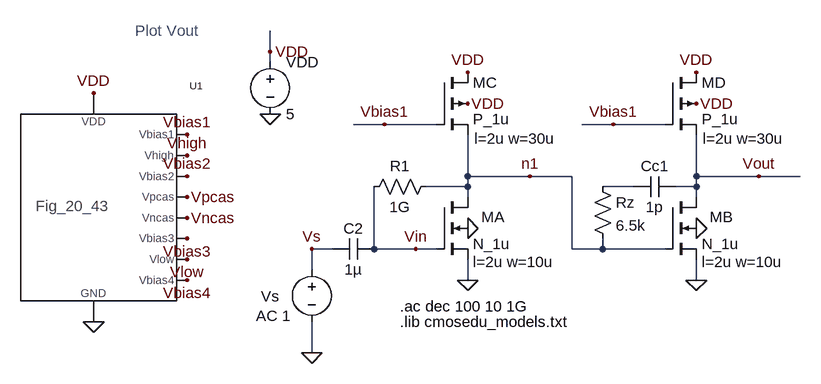
[diagram p0: schematic Fig21_34.asc]
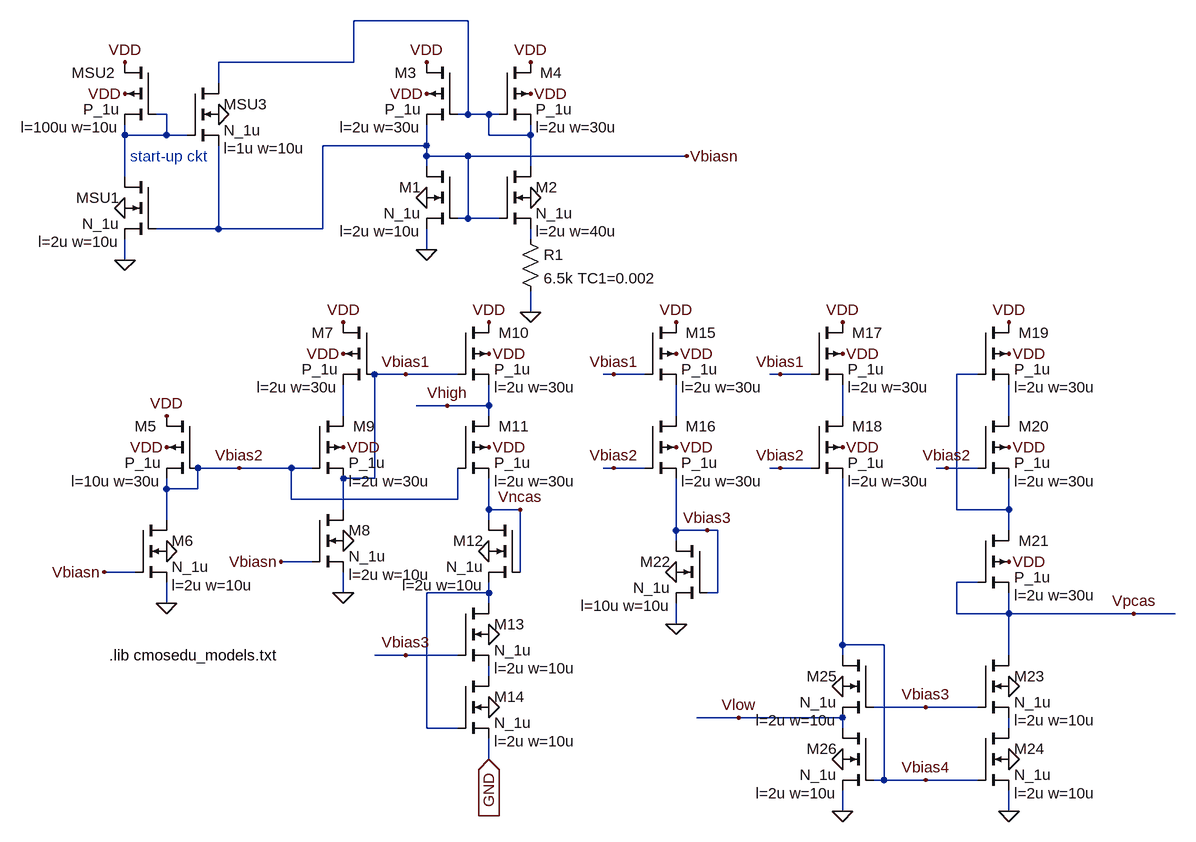
[diagram p1: sub-circuit fig_20_43.asc]
Fig21_34.asc, the LTspice schematic file:
Version 4
SHEET 1 1976 680
WIRE 1072 -304 1072 -336
WIRE 1072 -288 1072 -304
WIRE 1136 32 1136 0
WIRE 1136 160 1136 112
WIRE 1168 0 1136 0
WIRE 1232 0 1232 -96
WIRE 1248 -192 1200 -192
WIRE 1296 0 1232 0
WIRE 1328 -192 1248 -192
WIRE 1328 0 1296 0
WIRE 1376 -112 1376 -176
WIRE 1376 -96 1312 -96
WIRE 1376 -96 1376 -112
WIRE 1376 -80 1376 -96
WIRE 1376 48 1376 16
WIRE 1472 -112 1376 -112
WIRE 1536 -112 1472 -112
WIRE 1536 0 1536 -112
WIRE 1584 0 1536 0
WIRE 1584 0 1584 -16
WIRE 1600 -192 1552 -192
WIRE 1632 -96 1584 -96
WIRE 1680 -192 1600 -192
WIRE 1680 0 1584 0
WIRE 1728 -112 1728 -176
WIRE 1728 -96 1696 -96
WIRE 1728 -96 1728 -112
WIRE 1728 -80 1728 -96
WIRE 1728 48 1728 16
WIRE 1824 -112 1728 -112
WIRE 1888 -112 1824 -112
FLAG 1072 -208 0
FLAG 1072 -304 VDD
FLAG 1376 -32 0
FLAG 1376 48 0
FLAG 1376 -272 VDD
FLAG 1376 -224 VDD
FLAG 800 -240 VDD
FLAG 800 112 0
FLAG 944 -176 Vbias1
FLAG 944 -144 Vhigh
FLAG 944 -112 Vbias2
FLAG 944 -16 Vbias3
FLAG 944 -80 Vpcas
FLAG 944 -48 Vncas
FLAG 944 48 Vbias4
FLAG 944 16 Vlow
FLAG 1136 160 0
FLAG 1296 0 Vin
FLAG 1248 -192 Vbias1
FLAG 1136 0 Vs
FLAG 1728 -32 0
FLAG 1728 48 0
FLAG 1728 -272 VDD
FLAG 1728 -224 VDD
FLAG 1824 -112 Vout
FLAG 1600 -192 Vbias1
FLAG 1472 -112 n1
SYMBOL voltage 1072 -304 R0
WINDOW 123 0 0 Left 0
WINDOW 39 0 0 Left 0
SYMATTR InstName VDD
SYMATTR Value 5
SYMBOL nmos4 1328 -80 R0
WINDOW 123 56 100 Left 0
WINDOW 0 69 31 Left 0
SYMATTR Value2 l=2u w=10u
SYMATTR InstName MA
SYMATTR Value N_1u
SYMBOL pmos4 1328 -272 R0
WINDOW 123 58 102 Left 0
WINDOW 0 56 16 Left 0
SYMATTR Value2 l=2u w=30u
SYMATTR InstName MC
SYMATTR Value P_1u
SYMBOL Fig_20_43 800 -64 R0
SYMATTR InstName U1
SYMBOL voltage 1136 16 R0
WINDOW 123 -86 87 Left 0
WINDOW 39 0 0 Left 0
WINDOW 3 30 93 Left 0
WINDOW 0 -78 57 Left 0
SYMATTR Value2 AC 1
SYMATTR Value ""
SYMATTR InstName Vs
SYMBOL res 1216 -80 R270
WINDOW 0 32 56 VTop 0
WINDOW 3 0 56 VBottom 0
SYMATTR InstName R1
SYMATTR Value 1G
SYMBOL cap 1168 16 R270
WINDOW 0 32 32 VTop 0
WINDOW 3 0 32 VBottom 0
SYMATTR InstName C2
SYMATTR Value 1µ
SYMBOL nmos4 1680 -80 R0
WINDOW 123 56 100 Left 0
WINDOW 0 69 31 Left 0
SYMATTR Value2 l=2u w=10u
SYMATTR InstName MB
SYMATTR Value N_1u
SYMBOL pmos4 1680 -272 R0
WINDOW 123 58 102 Left 0
WINDOW 0 56 16 Left 0
SYMATTR Value2 l=2u w=30u
SYMATTR InstName MD
SYMATTR Value P_1u
SYMBOL cap 1632 -80 R270
WINDOW 0 32 32 VTop 0
WINDOW 3 0 32 VBottom 0
SYMATTR InstName Cc1
SYMATTR Value 1p
SYMBOL res 1568 -112 R0
SYMATTR InstName Rz
SYMATTR Value 6.5k
TEXT 1272 112 Left 0 !.lib cmosedu_models.txt
TEXT 864 -336 Left 0 ;Plot Vout
TEXT 1272 88 Left 0 !.ac dec 100 10 1G

fig_20_43.asc, the sub-circuit schematic file:
Version 4
SHEET 1 2164 1112
WIRE 544 16 544 0
WIRE 544 80 544 16
WIRE 544 208 544 176
WIRE 560 688 512 688
WIRE 608 -16 592 -16
WIRE 608 16 544 16
WIRE 608 16 608 -16
WIRE 608 560 608 544
WIRE 608 608 608 560
WIRE 608 736 608 704
WIRE 640 16 608 16
WIRE 656 560 608 560
WIRE 656 560 656 528
WIRE 688 -64 688 -96
WIRE 688 160 592 160
WIRE 688 160 688 32
WIRE 720 528 656 528
WIRE 800 528 720 528
WIRE 800 576 800 528
WIRE 832 528 800 528
WIRE 832 672 784 672
WIRE 848 160 688 160
WIRE 848 160 848 32
WIRE 880 448 880 400
WIRE 880 592 880 544
WIRE 880 720 880 688
WIRE 896 -96 688 -96
WIRE 896 -96 896 -160
WIRE 928 544 880 544
WIRE 928 544 928 384
WIRE 976 384 928 384
WIRE 976 816 928 816
WIRE 1008 32 848 32
WIRE 1008 32 1008 0
WIRE 1008 48 1008 32
WIRE 1008 64 1008 48
WIRE 1008 192 1008 160
WIRE 1008 928 1008 720
WIRE 1040 432 992 432
WIRE 1056 384 976 384
WIRE 1056 576 800 576
WIRE 1056 576 1056 528
WIRE 1056 816 976 816
WIRE 1056 928 1008 928
WIRE 1072 -160 896 -160
WIRE 1072 -16 1056 -16
WIRE 1072 -16 1072 -160
WIRE 1072 48 1008 48
WIRE 1072 144 1056 144
WIRE 1072 144 1072 48
WIRE 1104 -16 1072 -16
WIRE 1104 16 1104 -16
WIRE 1104 432 1040 432
WIRE 1104 432 1104 400
WIRE 1104 448 1104 432
WIRE 1104 592 1104 544
WIRE 1104 608 1104 592
WIRE 1104 720 1008 720
WIRE 1104 720 1104 704
WIRE 1104 736 1104 720
WIRE 1104 848 1104 832
WIRE 1104 976 1104 944
WIRE 1120 -16 1104 -16
WIRE 1120 144 1072 144
WIRE 1152 592 1104 592
WIRE 1152 688 1152 592
WIRE 1168 16 1104 16
WIRE 1168 16 1168 0
WIRE 1168 64 1168 16
WIRE 1168 176 1168 160
WIRE 1168 288 1168 256
WIRE 1296 384 1280 384
WIRE 1296 528 1280 528
WIRE 1344 384 1296 384
WIRE 1344 528 1296 528
WIRE 1392 448 1392 400
WIRE 1392 624 1392 544
WIRE 1392 640 1392 624
WIRE 1392 768 1392 736
WIRE 1408 48 1072 48
WIRE 1440 624 1392 624
WIRE 1456 624 1440 624
WIRE 1456 720 1440 720
WIRE 1456 720 1456 624
WIRE 1488 912 1424 912
WIRE 1552 384 1536 384
WIRE 1552 528 1536 528
WIRE 1600 384 1552 384
WIRE 1600 528 1552 528
WIRE 1648 448 1648 400
WIRE 1648 800 1648 544
WIRE 1648 816 1648 800
WIRE 1648 912 1488 912
WIRE 1648 912 1648 896
WIRE 1648 928 1648 912
WIRE 1648 1056 1648 1024
WIRE 1712 800 1648 800
WIRE 1712 1008 1696 1008
WIRE 1712 1008 1712 800
WIRE 1776 896 1696 896
WIRE 1776 1008 1712 1008
WIRE 1808 528 1792 528
WIRE 1824 592 1824 384
WIRE 1824 752 1824 704
WIRE 1856 384 1824 384
WIRE 1856 528 1808 528
WIRE 1856 704 1824 704
WIRE 1856 896 1776 896
WIRE 1856 1008 1776 1008
WIRE 1904 448 1904 400
WIRE 1904 592 1824 592
WIRE 1904 592 1904 544
WIRE 1904 624 1904 592
WIRE 1904 752 1824 752
WIRE 1904 752 1904 720
WIRE 1904 816 1904 752
WIRE 1904 928 1904 912
WIRE 1904 1056 1904 1024
WIRE 2096 752 1904 752
WIRE 2160 752 2096 752
FLAG 544 -48 VDD
FLAG 544 -96 VDD
FLAG 544 208 0
FLAG 544 128 0
FLAG 688 -16 0
FLAG 1008 -48 VDD
FLAG 1008 -96 VDD
FLAG 1168 -48 VDD
FLAG 1168 -96 VDD
FLAG 1008 192 0
FLAG 1008 112 0
FLAG 1168 288 0
FLAG 1168 112 0
FLAG 1408 48 Vbiasn
FLAG 608 496 VDD
FLAG 608 448 VDD
FLAG 608 736 0
FLAG 608 656 0
FLAG 512 688 Vbiasn
FLAG 880 352 VDD
FLAG 880 304 VDD
FLAG 880 720 0
FLAG 880 640 0
FLAG 784 672 Vbiasn
FLAG 880 496 VDD
FLAG 1104 352 VDD
FLAG 1104 304 VDD
FLAG 1104 496 VDD
FLAG 976 384 Vbias1
FLAG 1040 432 Vhigh
FLAG 720 528 Vbias2
FLAG 1104 656 0
FLAG 1152 592 Vncas
FLAG 1104 784 0
FLAG 1104 896 0
FLAG 976 816 Vbias3
FLAG 1392 352 VDD
FLAG 1392 304 VDD
FLAG 1392 496 VDD
FLAG 1296 384 Vbias1
FLAG 1296 528 Vbias2
FLAG 1648 352 VDD
FLAG 1648 304 VDD
FLAG 1648 496 VDD
FLAG 1552 384 Vbias1
FLAG 1552 528 Vbias2
FLAG 1904 352 VDD
FLAG 1904 304 VDD
FLAG 1904 496 VDD
FLAG 1808 528 Vbias2
FLAG 1904 672 VDD
FLAG 2096 752 Vpcas
FLAG 1392 768 0
FLAG 1392 688 0
FLAG 1440 624 Vbias3
FLAG 1904 864 0
FLAG 1904 976 0
FLAG 1904 1056 0
FLAG 1648 864 0
FLAG 1648 976 0
FLAG 1648 1056 0
FLAG 1776 896 Vbias3
FLAG 1488 912 Vlow
FLAG 1776 1008 Vbias4
FLAG 1104 976 GND
IOPIN 1104 976 In
SYMBOL pmos4 592 -96 M0
WINDOW 0 63 16 Left 0
WINDOW 123 56 100 Left 0
SYMATTR InstName MSU2
SYMATTR Value2 l=100u w=10u
SYMATTR Value P_1u
SYMBOL nmos4 592 80 M0
WINDOW 123 56 100 Left 0
SYMATTR Value2 l=2u w=10u
SYMATTR InstName MSU1
SYMATTR Value N_1u
SYMBOL nmos4 640 -64 R0
WINDOW 123 56 100 Left 0
SYMATTR Value2 l=1u w=10u
SYMATTR InstName MSU3
SYMATTR Value N_1u
SYMBOL pmos4 1056 -96 M0
WINDOW 0 63 16 Left 0
WINDOW 123 56 100 Left 0
SYMATTR InstName M3
SYMATTR Value2 l=2u w=30u
SYMATTR Value P_1u
SYMBOL pmos4 1120 -96 R0
WINDOW 0 63 16 Left 0
WINDOW 123 56 100 Left 0
SYMATTR InstName M4
SYMATTR Value2 l=2u w=30u
SYMATTR Value P_1u
SYMBOL nmos4 1056 64 M0
WINDOW 123 56 100 Left 0
SYMATTR Value2 l=2u w=10u
SYMATTR InstName M1
SYMATTR Value N_1u
SYMBOL nmos4 1120 64 R0
WINDOW 123 56 100 Left 0
SYMATTR Value2 l=2u w=40u
SYMATTR InstName M2
SYMATTR Value N_1u
SYMBOL res 1152 160 R0
SYMATTR InstName R1
SYMATTR Value 6.5k TC1=0.002
SYMBOL pmos4 656 448 M0
WINDOW 0 63 16 Left 0
WINDOW 123 56 100 Left 0
SYMATTR InstName M5
SYMATTR Value2 l=10u w=30u
SYMATTR Value P_1u
SYMBOL nmos4 560 608 R0
WINDOW 123 56 100 Left 0
SYMATTR Value2 l=2u w=10u
SYMATTR InstName M6
SYMATTR Value N_1u
SYMBOL pmos4 928 304 M0
WINDOW 0 63 16 Left 0
WINDOW 123 56 100 Left 0
SYMATTR InstName M7
SYMATTR Value2 l=2u w=30u
SYMATTR Value P_1u
SYMBOL nmos4 832 592 R0
WINDOW 123 56 100 Left 0
SYMATTR Value2 l=2u w=10u
SYMATTR InstName M8
SYMATTR Value N_1u
SYMBOL pmos4 832 448 R0
WINDOW 0 63 16 Left 0
WINDOW 123 56 100 Left 0
SYMATTR InstName M9
SYMATTR Value2 l=2u w=30u
SYMATTR Value P_1u
SYMBOL pmos4 1056 304 R0
WINDOW 0 63 16 Left 0
WINDOW 123 56 100 Left 0
SYMATTR InstName M10
SYMATTR Value2 l=2u w=30u
SYMATTR Value P_1u
SYMBOL pmos4 1056 448 R0
WINDOW 0 63 16 Left 0
WINDOW 123 56 100 Left 0
SYMATTR InstName M11
SYMATTR Value2 l=2u w=30u
SYMATTR Value P_1u
SYMBOL nmos4 1152 608 M0
WINDOW 123 56 100 Left 0
SYMATTR Value2 l=2u w=10u
SYMATTR InstName M12
SYMATTR Value N_1u
SYMBOL nmos4 1056 736 R0
WINDOW 123 56 100 Left 0
SYMATTR Value2 l=2u w=10u
SYMATTR InstName M13
SYMATTR Value N_1u
SYMBOL nmos4 1056 848 R0
WINDOW 123 56 100 Left 0
SYMATTR Value2 l=2u w=10u
SYMATTR InstName M14
SYMATTR Value N_1u
SYMBOL pmos4 1344 304 R0
WINDOW 0 63 16 Left 0
WINDOW 123 56 100 Left 0
SYMATTR InstName M15
SYMATTR Value2 l=2u w=30u
SYMATTR Value P_1u
SYMBOL pmos4 1344 448 R0
WINDOW 0 63 16 Left 0
WINDOW 123 56 100 Left 0
SYMATTR InstName M16
SYMATTR Value2 l=2u w=30u
SYMATTR Value P_1u
SYMBOL pmos4 1600 304 R0
WINDOW 0 63 16 Left 0
WINDOW 123 56 100 Left 0
SYMATTR InstName M17
SYMATTR Value2 l=2u w=30u
SYMATTR Value P_1u
SYMBOL pmos4 1600 448 R0
WINDOW 0 63 16 Left 0
WINDOW 123 56 100 Left 0
SYMATTR InstName M18
SYMATTR Value2 l=2u w=30u
SYMATTR Value P_1u
SYMBOL pmos4 1856 304 R0
WINDOW 0 63 16 Left 0
WINDOW 123 56 100 Left 0
SYMATTR InstName M19
SYMATTR Value2 l=2u w=30u
SYMATTR Value P_1u
SYMBOL pmos4 1856 448 R0
WINDOW 0 63 16 Left 0
WINDOW 123 56 100 Left 0
SYMATTR InstName M20
SYMATTR Value2 l=2u w=30u
SYMATTR Value P_1u
SYMBOL pmos4 1856 624 R0
WINDOW 0 63 16 Left 0
WINDOW 123 56 100 Left 0
SYMATTR InstName M21
SYMATTR Value2 l=2u w=30u
SYMATTR Value P_1u
SYMBOL nmos4 1440 640 M0
WINDOW 123 56 100 Left 0
SYMATTR Value2 l=10u w=10u
SYMATTR InstName M22
SYMATTR Value N_1u
SYMBOL nmos4 1856 816 R0
WINDOW 123 56 100 Left 0
SYMATTR Value2 l=2u w=10u
SYMATTR InstName M23
SYMATTR Value N_1u
SYMBOL nmos4 1856 928 R0
WINDOW 123 56 100 Left 0
SYMATTR Value2 l=2u w=10u
SYMATTR InstName M24
SYMATTR Value N_1u
SYMBOL nmos4 1696 816 M0
WINDOW 123 56 100 Left 0
SYMATTR Value2 l=2u w=10u
SYMATTR InstName M25
SYMATTR Value N_1u
SYMBOL nmos4 1696 928 M0
WINDOW 123 56 100 Left 0
SYMATTR Value2 l=2u w=10u
SYMATTR InstName M26
SYMATTR Value N_1u
TEXT 552 48 Left 0 ;start-up ckt
TEXT 520 816 Left 0 !.lib cmosedu_models.txt

The netlist it stands for:
* Fig21_34.asc
VDD VDD 0 5
MA n1 Vin 0 0 N_1u l=2u w=10u
MC VDD Vbias1 n1 VDD P_1u l=2u w=30u
XU1 Vbias1 Vhigh Vbias2 Vpcas Vncas Vbias3 Vlow Vbias4 VDD 0 fig_20_43
Vs Vs 0 AC 1
R1 Vin n1 1G
C2 Vs Vin 1µ
MB Vout n1 0 0 N_1u l=2u w=10u
MD VDD Vbias1 Vout VDD P_1u l=2u w=30u
Cc1 N001 Vout 1p
Rz N001 n1 6.5k

* block symbol definitions
.subckt fig_20_43 Vbias1 Vhigh Vbias2 Vpcas Vncas Vbias3 Vlow Vbias4 VDD GND
MSU2 VDD N001 N001 VDD P_1u l=100u w=10u
MSU1 N001 Vbiasn 0 0 N_1u l=2u w=10u
MSU3 N002 N001 Vbiasn 0 N_1u l=1u w=10u
M3 VDD N002 Vbiasn VDD P_1u l=2u w=30u
M4 VDD N002 N002 VDD P_1u l=2u w=30u
M1 Vbiasn Vbiasn 0 0 N_1u l=2u w=10u
M2 N002 Vbiasn N006 0 N_1u l=2u w=40u
R1 N006 0 6.5k TC1=0.002
M5 VDD Vbias2 Vbias2 VDD P_1u l=10u w=30u
M6 Vbias2 Vbiasn 0 0 N_1u l=2u w=10u
M7 VDD Vbias1 N003 VDD P_1u l=2u w=30u
M8 Vbias1 Vbiasn 0 0 N_1u l=2u w=10u
M9 N003 Vbias2 Vbias1 VDD P_1u l=2u w=30u
M10 VDD Vbias1 Vhigh VDD P_1u l=2u w=30u
M11 Vhigh Vbias2 Vncas VDD P_1u l=2u w=30u
M12 Vncas Vncas N004 0 N_1u l=2u w=10u
M13 N004 Vbias3 N005 0 N_1u l=2u w=10u
M14 N005 N004 GND 0 N_1u l=2u w=10u
M15 VDD Vbias1 N007 VDD P_1u l=2u w=30u
M16 N007 Vbias2 Vbias3 VDD P_1u l=2u w=30u
M17 VDD Vbias1 N008 VDD P_1u l=2u w=30u
M18 N008 Vbias2 Vbias4 VDD P_1u l=2u w=30u
M19 VDD N009 N010 VDD P_1u l=2u w=30u
M20 N010 Vbias2 N009 VDD P_1u l=2u w=30u
M21 N009 Vpcas Vpcas VDD P_1u l=2u w=30u
M22 Vbias3 Vbias3 0 0 N_1u l=10u w=10u
M23 Vpcas Vbias3 N011 0 N_1u l=2u w=10u
M24 N011 Vbias4 0 0 N_1u l=2u w=10u
M25 Vbias4 Vbias3 Vlow 0 N_1u l=2u w=10u
M26 Vlow Vbias4 0 0 N_1u l=2u w=10u
* start-up ckt
.lib cmosedu_models.txt
.ends fig_20_43

.model NMOS NMOS
.model PMOS PMOS
.lib standard.mos
.lib cmosedu_models.txt
* Plot Vout
.ac dec 100 10 1G
.backanno
.end